# EAGLE design RFM12-Shield_2.0 (EAGLE 5.11)
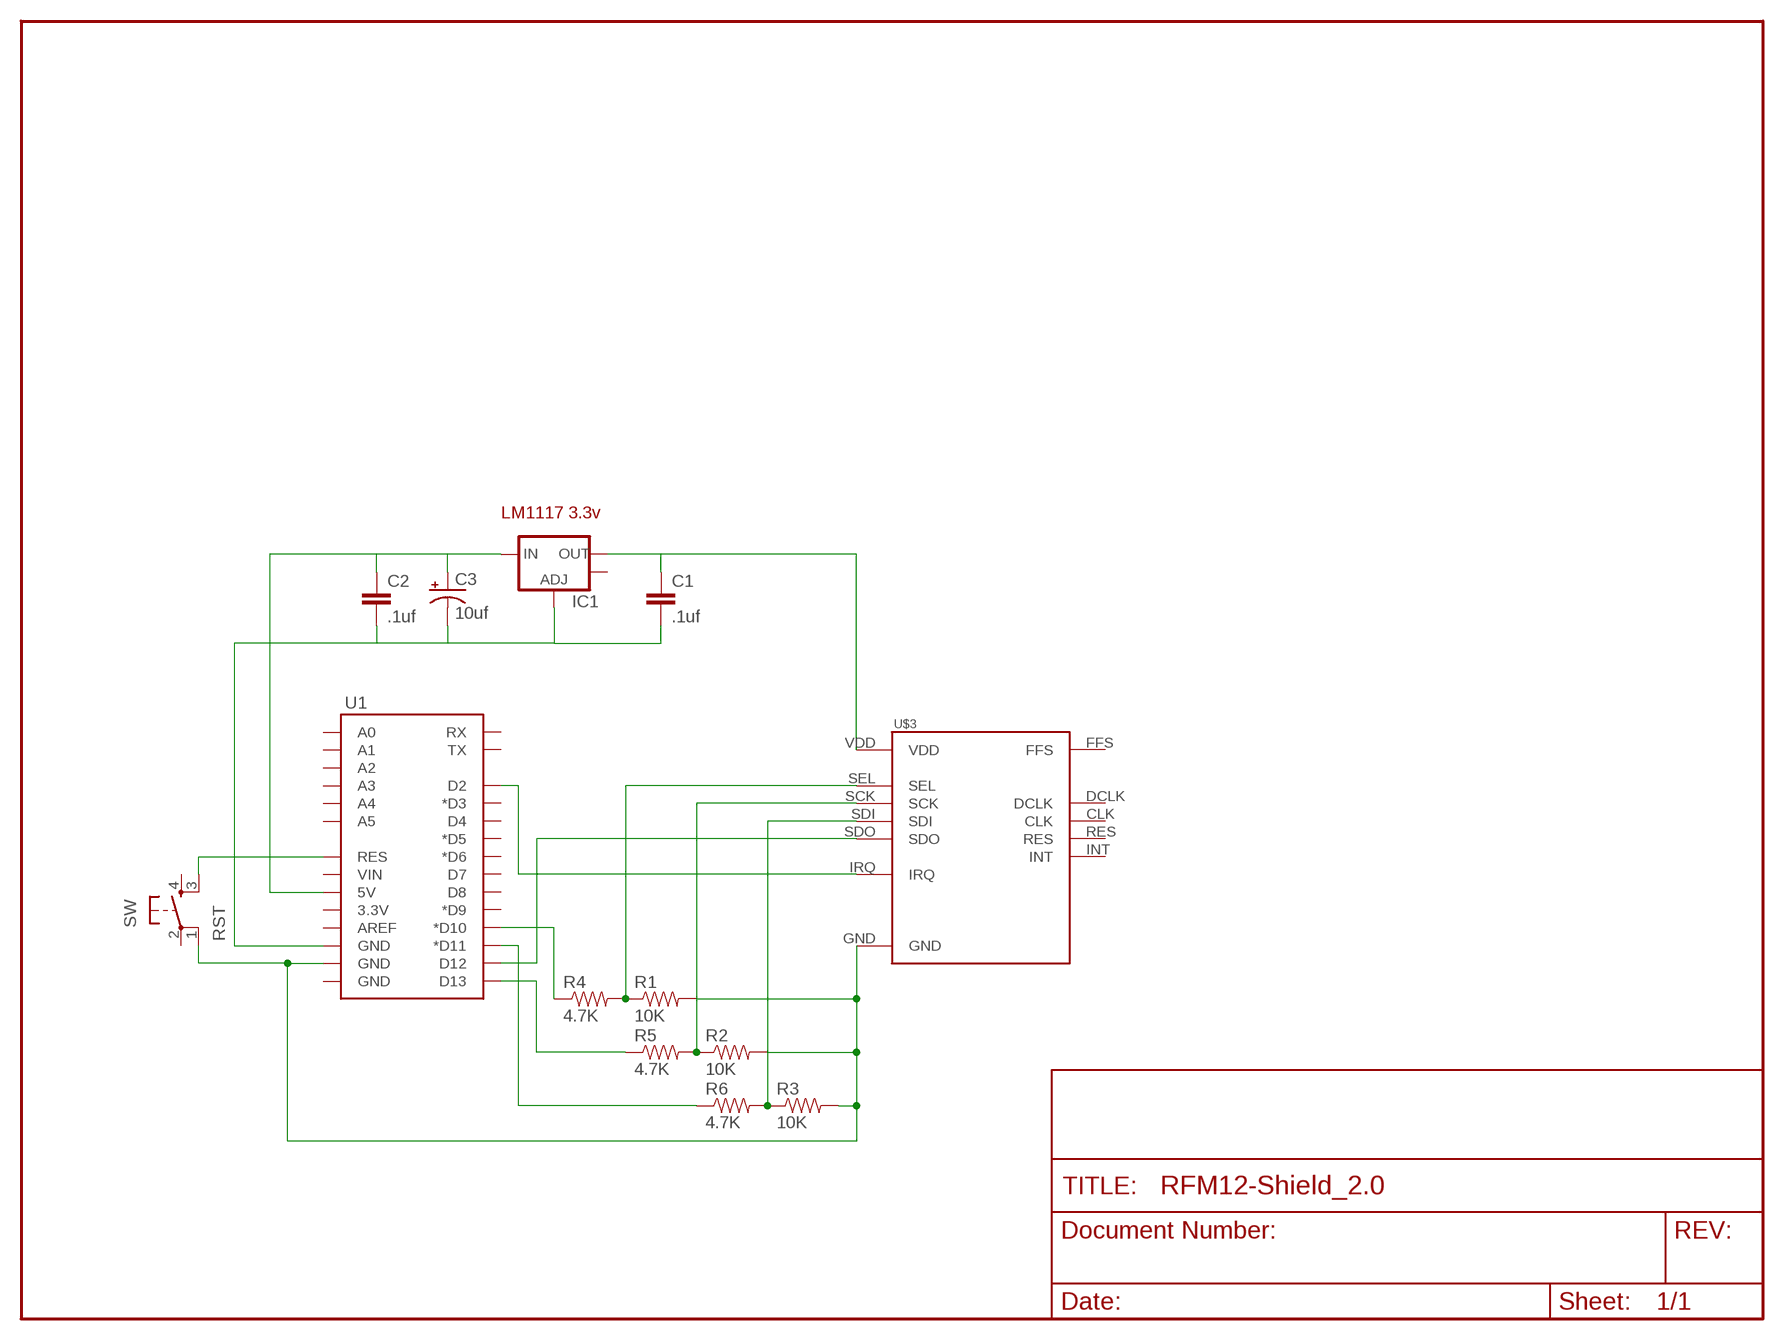
[diagram p0: schematic, sheet 1]

## Parts
C1  .1uf  CAPPTH1  [CAP-PTH-5MM]
C2  .1uf  CAPPTH1  [CAP-PTH-5MM]
C3  10uf  CAP_POLPTH1  [CPOL-RADIAL-100UF-25V]
IC1  V_REG_LM1117SOT223  [SOT223]
R1  10K  RESISTORPTH1  [AXIAL-0.3]
R2  10K  RESISTORPTH1  [AXIAL-0.3]
R3  10K  RESISTORPTH1  [AXIAL-0.3]
R4  4.7K  RESISTORPTH1  [AXIAL-0.3]
R5  4.7K  RESISTORPTH1  [AXIAL-0.3]
R6  4.7K  RESISTORPTH1  [AXIAL-0.3]
SW  RST  SWITCH2  [SW2_6.5MMX5MM]
U1  ARDUINO_SHIELDLABEL  [DUEMILANOVE_SHIELD]
U$3  RFM12B-BO  [RFM-BO]

## Nets
N$1: SW.3(S1) U1.RES
N$2: R1.P$1 R4.P$2 U$3.SEL
N$3: R2.P$1 R5.P$2 U$3.SCK
N$4: R3.P$1 R6.P$2 U$3.SDI
N$5: U1.D12 U$3.SDO
N$6: U1.D2 U$3.IRQ
N$7: R5.P$1 U1.D13
N$8: R4.P$1 U1.D10(*D10)
N$9: R6.P$1 U1.D11(*D11)
N$10: C2.1 C3.1(+) IC1.3(IN) U1.5V
N$11: C1.2 C2.2 C3.2(-) IC1.1(ADJ) U1.GND@2(GND)
N$16: R1.P$2 R2.P$2 R3.P$2 SW.1 U1.GND@1(GND) U$3.GND
N$17: C1.1 IC1.2(OUT) U$3.VDD
Unconnected: IC1.4(OUT) SW.2(P) SW.4(S) U1.3.3V U1.A0 U1.A1 U1.A2 U1.A3 U1.A4 U1.A5 U1.AREF U1.D3(*D3) U1.D4 U1.D5(*D5) U1.D6(*D6) U1.D7 U1.D8 U1.D9(*D9) U1.GND@0(GND) U1.RX U1.TX U1.VIN U$3.CLK U$3.DCLK U$3.FFS U$3.INT U$3.RES

## Notes on the sheet
- LM1117 3.3v

## Library data of the parts
C1 C2 = SparkFun:CAP: Capacitor Standard 0603 ceramic capacitor, and 0.1" leaded capacitor.
C3 = SparkFun:CAP_POL: Capacitor Polarized These are standard SMD and PTH capacitors. Normally 10uF, 47uF, and 100uF in electrolytic and tantalum varieties. Always verify the external diameter of the through hole cap, it varies with capacity, voltage, and manufacturer. The EIA devices should be standard.
IC1 = SparkFun:V_REG_LM1117: Voltage Regulator LM1117 Standard adjustable voltage regulator but in SMD form. Spark Fun Electronics SKU : COM-00595
R1-R6 = SparkFun:RESISTOR: Resistor Basic schematic elements and footprints for 0603, 1206, and PTH 1/10th watt (small) resistors.
SW = Tropotek:SWITCH2
U1 = SparkFun:ARDUINO_SHIELD
U$3 = Tropotek:RFM12B-BO

## Board
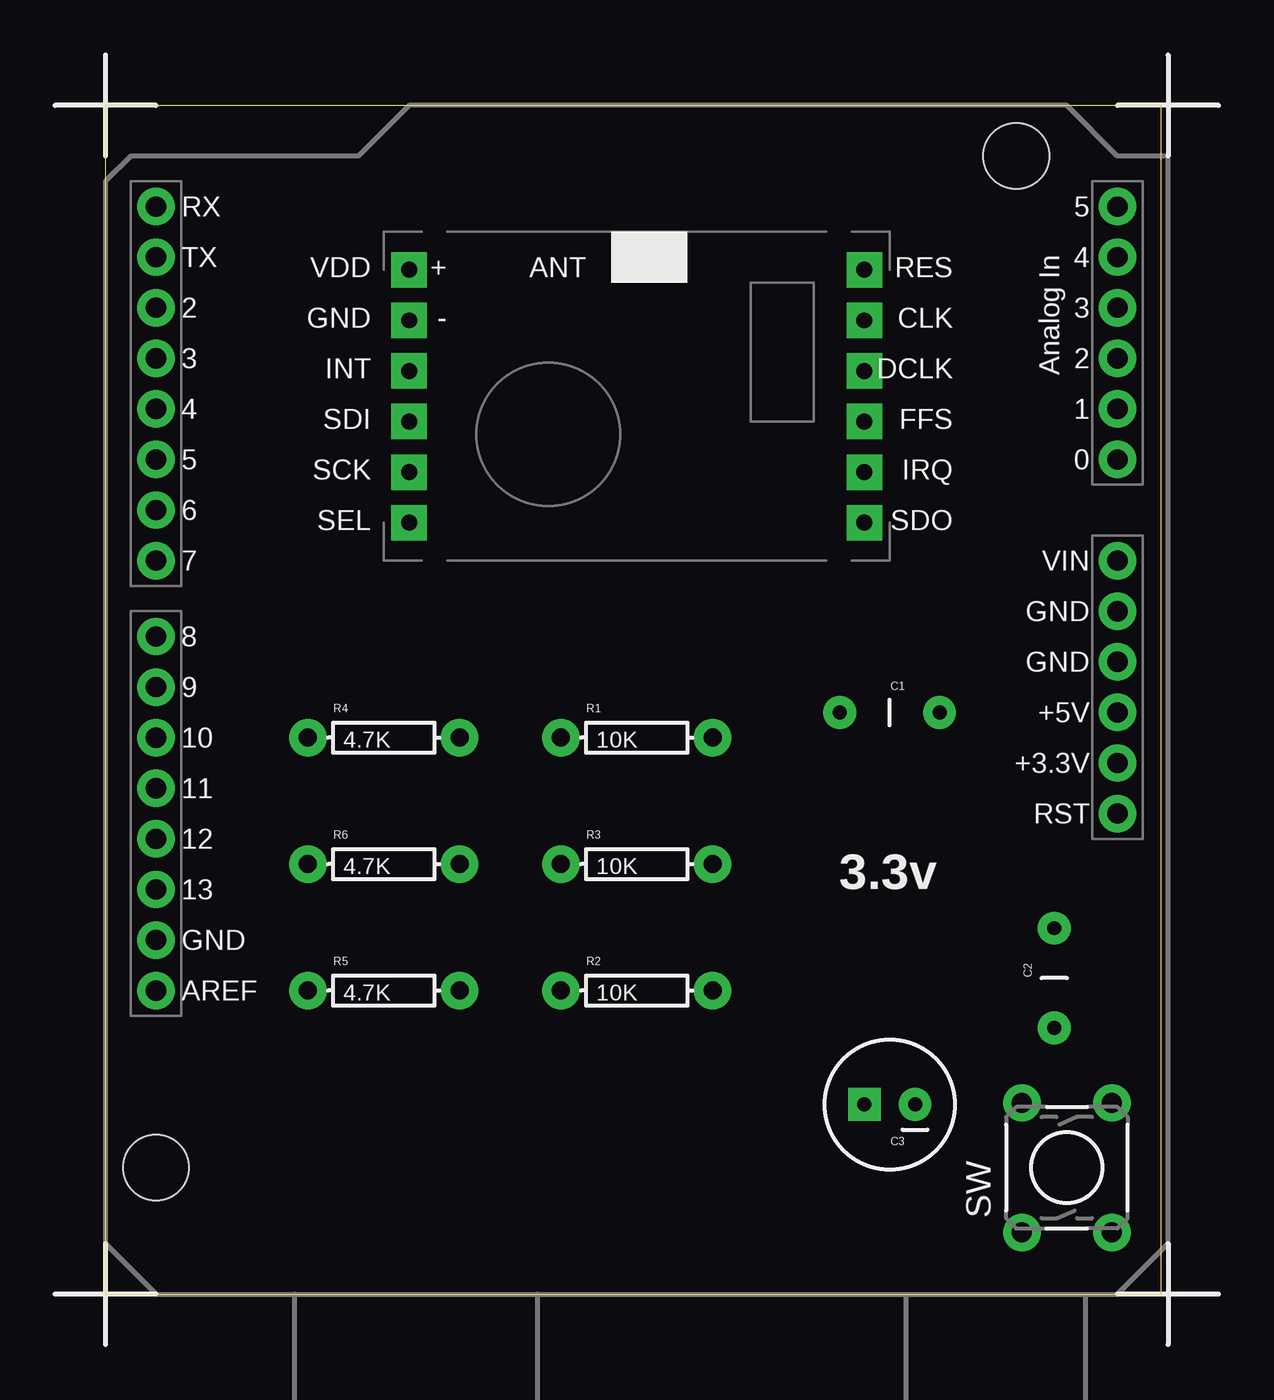
[diagram p1: board, top side]
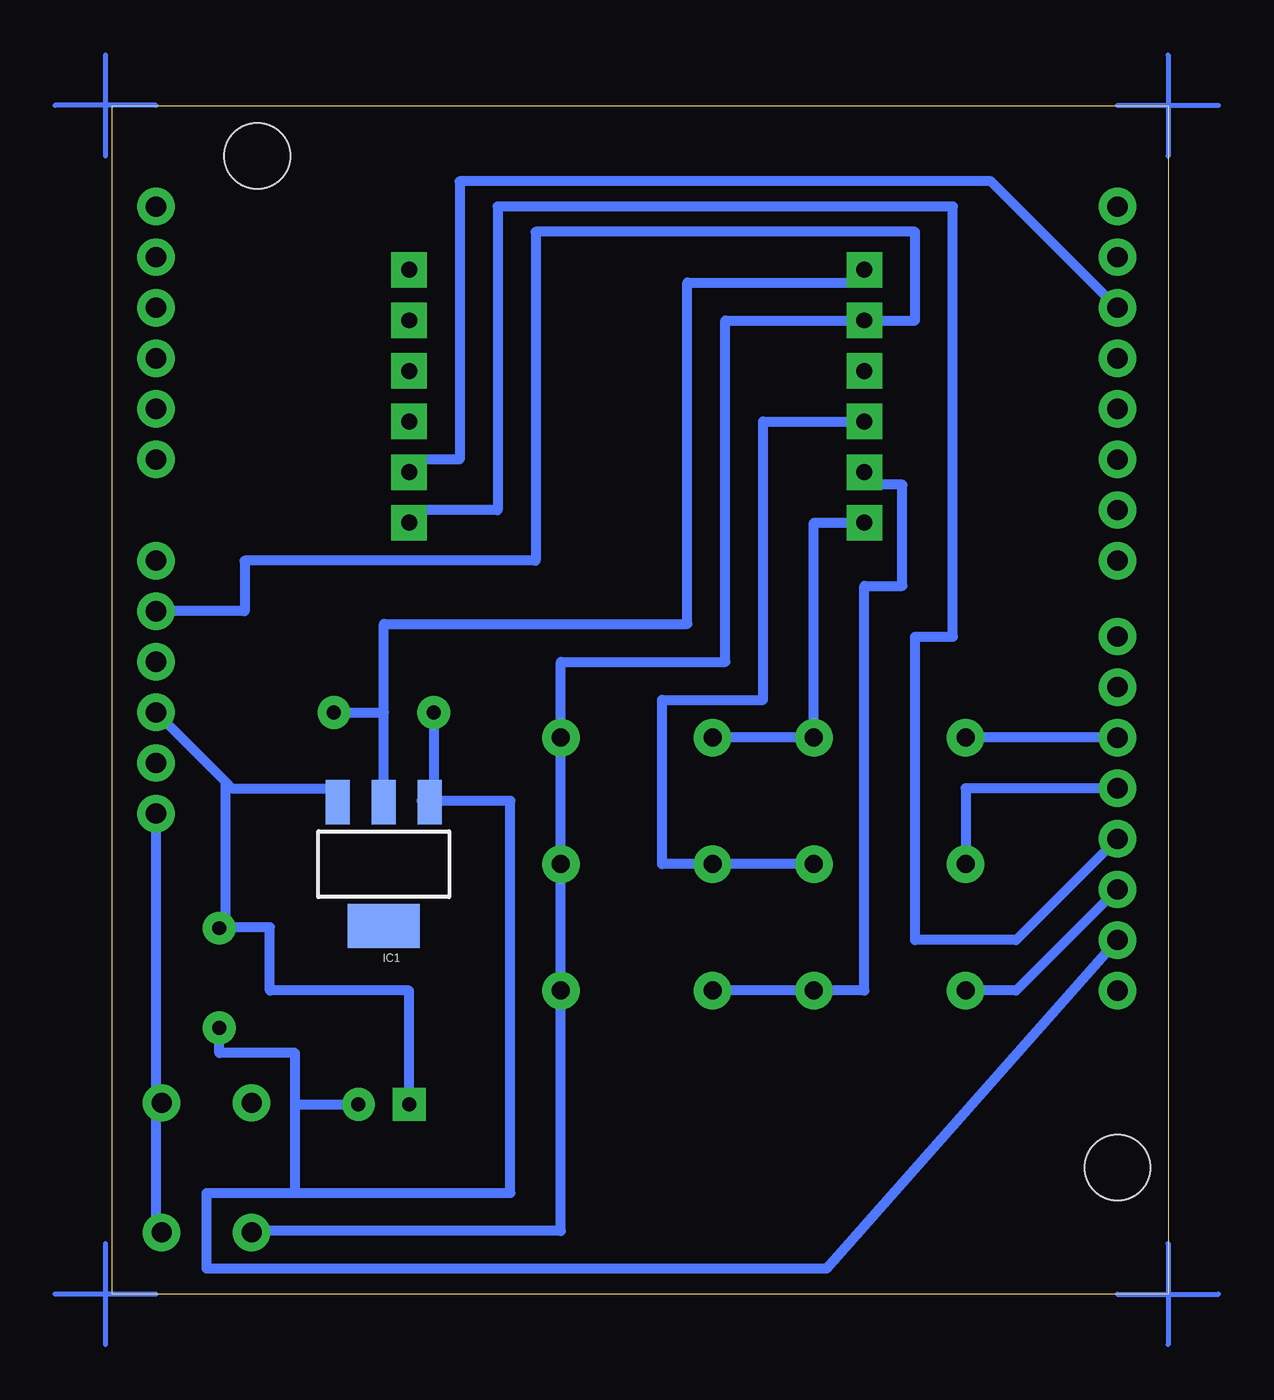
[diagram p2: board, bottom side, seen from below]

Size 53.01 x 59.68 mm. Coordinates in mm from the lower left corner, seen from the top.
Outline: 0,0 53.01,0 53.01,59.68 0,59.68 0,0
Copper layers (1*16): Top 0.035mm / dielectric 1.5mm / Bottom 0.035mm
Design rules "default *": minimum track width 20mil, minimum drill 24mil, track to track 12mil, track to pad 12mil, pad to pad 12mil, via to via 12mil, smd to smd 12mil, copper to edge 40mil, drill to drill 12mil, minimum pad ring 10mil, minimum via ring 8mil, stop-mask expansion 4mil, vias tented up to drill 0mil, thermal gap 10mil

### Footprints (pad centres in the part's own frame; a part is rotated, then mirrored left to right if it is on the bottom)
CAP-PTH-5MM = drill 0.7 pad 1.651 round: 1 -2.5,0; 2 2.5,0
CPOL-RADIAL-100UF-25V = drill 0.7 pad 1.651 square: 1 1.27,0 | drill 0.7 pad 1.651 round: 2 -1.27,0
SOT223 = smd 1.219 x 2.235: 1 -2.311,-3.099; 2 0,-3.099; 3 2.311,-3.099 | smd 3.6 x 2.2: 4 0,3.099
AXIAL-0.3 = drill 0.9 pad 1.88 round: P$1 -3.81,0; P$2 3.81,0
SW2_6.5MMX5MM = drill 1.016 pad 1.88 round: 1 -3.251,2.261; 2 3.251,2.261; 3 -3.251,-2.261; 4 3.251,-2.261
DUEMILANOVE_SHIELD = drill 1.016 pad 1.88 round: 3.3V 50.8,26.67; 5V 50.8,29.21; A0 50.8,41.91; A1 50.8,44.45; A2 50.8,46.99; A3 50.8,49.53; A4 50.8,52.07; A5 50.8,54.61; AREF 2.54,15.24; D2 2.54,49.53; D3 2.54,46.99; D4 2.54,44.45; D5 2.54,41.91; D6 2.54,39.37; D7 2.54,36.83; D8 2.54,33.02; D9 2.54,30.48; D10 2.54,27.94; D11 2.54,25.4; D12 2.54,22.86; D13 2.54,20.32; GND@0 50.8,31.75; GND@1 50.8,34.29; GND@2 2.54,17.78; RES 50.8,24.13; RX 2.54,54.61; TX 2.54,52.07; VIN 50.8,36.83 | hole 3.302: 45.72,57.15; 2.54,6.35
RFM-BO = drill 0.8 pad 1.778 square: CLK -11.43,-1.905; DCLK -11.43,0.635; FFS -11.43,3.175; GND 11.43,-1.905; INT 11.43,0.635; IRQ -11.43,5.715; RES -11.43,-4.445; SCK 11.43,5.715; SDI 11.43,3.175; SDO -11.43,8.255; SEL 11.43,8.255; VDD 11.43,-4.445

### Placement (x,y rotation side)
C1  39.37,29.21 180 top
C2  47.62,15.88 270 top
C3  39.37,9.53 180 top
IC1  39.37,21.59 180 bottom
R1  26.67,27.94 0 top
R2  26.67,15.24 0 top
R3  26.67,21.59 0 top
R4  13.97,27.94 0 top
R5  13.97,15.24 0 top
R6  13.97,21.59 0 top
SW  48.26,6.35 90 top
U1  0,0 0 top
U$3  26.67,46.99 180 top

### Tracks (layer width: path | path; a pad name or v marks a point on that pad's centre or on a via)
N$1
  Bottom 0.508: U1.RES 50.8,3.81 SW.3
N$2
  Bottom 0.508: U$3.SEL 17.78,38.73 R4.P$2 R1.P$1
N$3
  Bottom 0.508: U$3.SCK 15.24,40.64 13.34,40.64 13.34,35.56 15.24,35.56 15.24,15.24 R5.P$2 R2.P$1
N$4
  Bottom 0.508: U$3.SDI 20.32,43.81 20.32,29.84 25.4,29.84 25.4,21.59 R3.P$1 R6.P$2
N$5
  Bottom 0.508: U1.D12 7.62,17.78 12.7,17.78 12.7,33.02 10.79,33.02 10.79,54.61 33.66,54.61 33.66,39.37 38.1,39.37 U$3.SDO
N$6
  Bottom 0.508: U1.D2 8.89,55.88 35.56,55.88 35.56,41.91 38.1,41.91 U$3.IRQ
N$7
  Bottom 0.508: U1.D13 7.62,15.24 R5.P$1
N$8
  Bottom 0.508: U1.D10 R4.P$1
N$9
  Bottom 0.508: U1.D11 10.16,25.4 R6.P$1
N$10
  Bottom 0.406: 47.62,18.41 C2.1 47.31,18.38
  Bottom 0.508: 47.31,25.72 46.99,25.4 41.91,25.4 IC1.3 | 47.31,25.72 U1.5V | C3.1 38.1,15.24 45.09,15.24 45.09,18.41 47.62,18.41 | 47.31,18.38 47.31,25.72
N$11
  Bottom 0.508: C1.2 36.83,29.21 36.83,25.4 IC1.1 37.47,24.77 33.02,24.77 33.02,5.08 43.81,5.08 | U1.GND@2 17.14,1.27 48.26,1.27 48.26,5.08 43.81,5.08 | C2.2 47.62,12.7 47.62,12.11 43.81,12.11 43.81,9.53 | 43.81,9.53 C3.2 | 43.81,5.08 43.81,9.53
N$12
  Bottom 0.254: 0,2.54 0,-2.54
N$13
  Bottom 0.254: 2.54,0 -2.54,0
N$14
  Bottom 0.254: 50.8,0 55.88,0
N$15
  Bottom 0.254: 53.34,2.54 53.34,-2.54
N$16
  Bottom 0.508: 45.72,3.17 SW.1 46,3.17 30.48,3.17 R2.P$2 R3.P$2 R1.P$2 30.48,31.75 22.23,31.75 22.23,48.9 U$3.GND 12.7,48.9 12.7,53.34 31.75,53.34 31.75,36.83 46.35,36.83 46.35,34.29 U1.GND@1
N$17
  Bottom 0.508: IC1.2 39.37,29.21 | 39.37,29.21 39.37,33.66 24.13,33.66 24.13,50.8 15.24,50.8 U$3.VDD | 39.37,29.21 C1.1 41.91,29.21
N$18
  Bottom 0.254: 50.8,59.69 55.88,59.69
N$19
  Bottom 0.254: 53.34,62.23 53.34,57.15
N$20
  Bottom 0.254: 0,62.23 0,57.15
N$21
  Bottom 0.254: 2.54,59.69 -2.54,59.69

### Text on the board
tPlace: 3.3v